# Altium schematic sheet LoRaBoard.SchDoc
size A
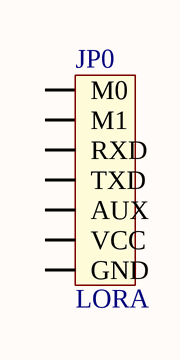
[diagram p0: LoRaBoard.SchDoc]

## Parts
JP0  LORA  [CON7]

## Nets

Not connected (* = marked no-connect by the designer): JP0 1(M0) 2(M1) 3(RXD) 4(TXD) 5(AUX) 6(VCC) 7(GND)

## Library data of the parts
JP0 = Con7: Connector 7; Value: Connector 7